# Altium schematic sheet MAIN.SchDoc
size A; DrawnBy: Eduardo
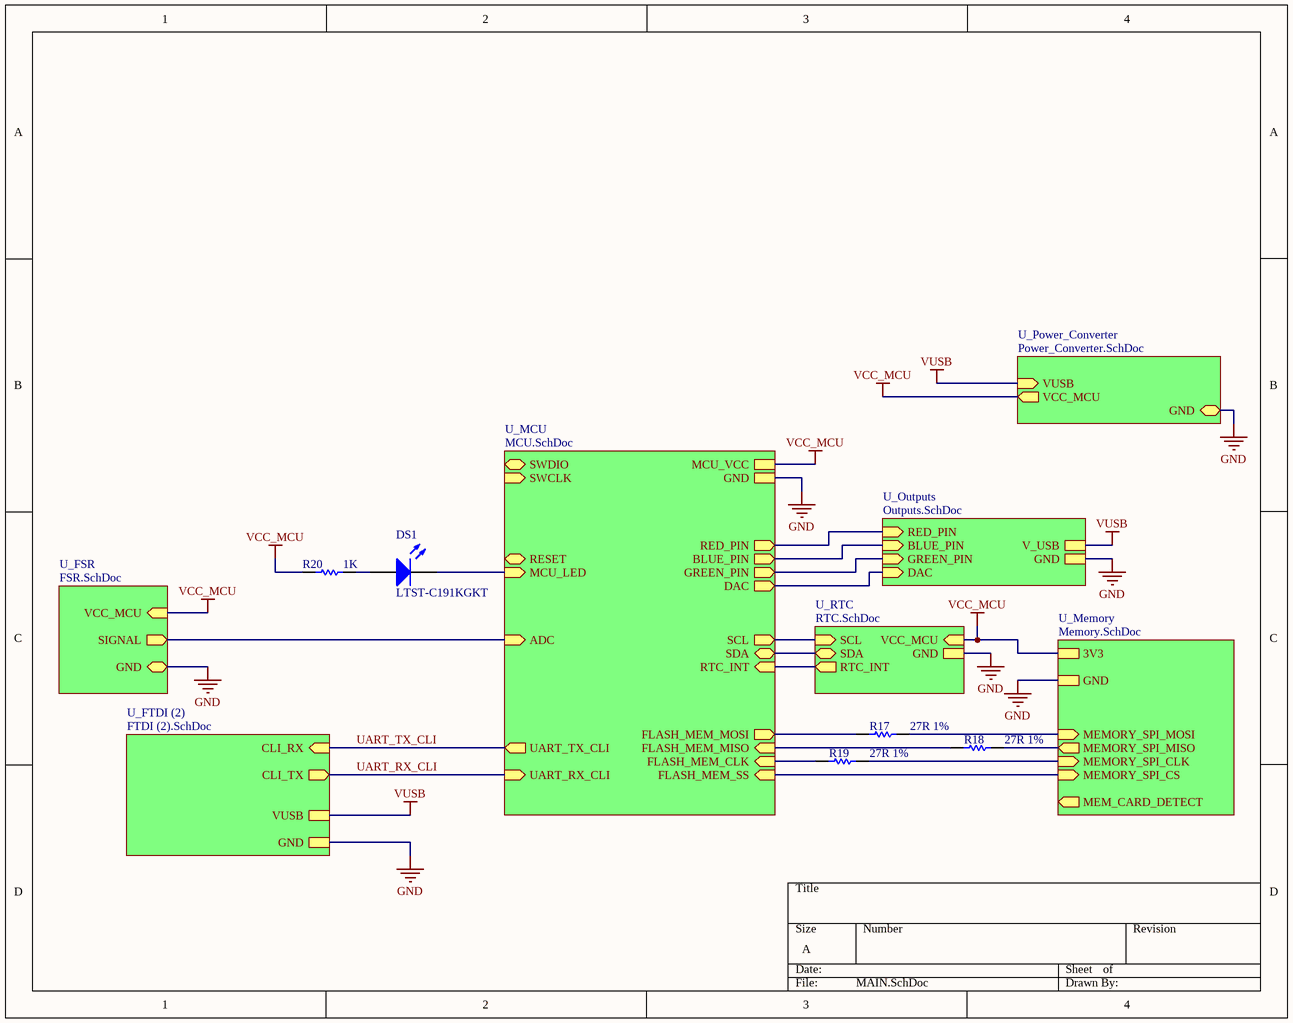
[diagram p0: MAIN.SchDoc]

## Parts
DS1  LTST-C191KGKT  [LITE-ON-LTST-C191KRKT-2_V]
R17  27R 1%  [RESC0603(1608)_N]
R18  27R 1%  [RESC0603(1608)_N]
R19  27R 1%  [RESC0603(1608)_N]
R20  1K  [RESC0603(1608)_M]

## Sub-sheets
U_FSR = FSR.SchDoc: VCC_MCU (in), SIGNAL (out), GND (bidir)
U_FTDI (2) = FTDI (2).SchDoc: CLI_RX (in), CLI_TX (out), VUSB, GND
U_MCU = MCU.SchDoc: SWDIO (bidir), SWCLK (in), UART_TX_CLI (out), UART_RX_CLI (in), FLASH_MEM_SS (in), FLASH_MEM_CLK (in), FLASH_MEM_MISO (in), FLASH_MEM_MOSI (out), RESET (bidir), MCU_LED (in), MCU_VCC, GND, SDA (bidir), SCL (out), DAC (out), RED_PIN (out), GREEN_PIN (out), BLUE_PIN (out), ADC (in), RTC_INT (in)
U_Memory = Memory.SchDoc: MEMORY_SPI_MOSI (in), MEMORY_SPI_MISO (out), MEMORY_SPI_CLK (in), MEMORY_SPI_CS (in), MEM_CARD_DETECT (out), GND, 3V3
U_Outputs = Outputs.SchDoc: RED_PIN (in), BLUE_PIN (in), GREEN_PIN (in), DAC (in), V_USB, GND
U_Power_Converter = Power_Converter.SchDoc: VUSB (in), VCC_MCU (out), GND (bidir)
U_RTC = RTC.SchDoc: SCL (in), RTC_INT (out), SDA (bidir), VCC_MCU (in), GND

## Nets
GND: sheet U_MCU/GND, sheet U_Memory/GND, sheet U_RTC/GND, sheet U_Outputs/GND, sheet U_Power_Converter/GND, sheet U_FSR/GND, sheet U_FTDI (2)/GND
VCC_MCU: R20.1 ; sheet U_MCU/MCU_VCC, sheet U_Memory/3V3, sheet U_RTC/VCC_MCU, sheet U_Power_Converter/VCC_MCU, sheet U_FSR/VCC_MCU
VUSB: sheet U_Outputs/V_USB, sheet U_Power_Converter/VUSB, sheet U_FTDI (2)/VUSB
UART_RX_CLI: sheet U_MCU/UART_RX_CLI, sheet U_FTDI (2)/CLI_TX
UART_TX_CLI: sheet U_MCU/UART_TX_CLI, sheet U_FTDI (2)/CLI_RX
NetDS1_1: DS1.1(A) R20.2
NetDS1_2: DS1.2(K) ; sheet U_MCU/MCU_LED
NetR17_1: R17.1 ; sheet U_MCU/FLASH_MEM_MOSI
NetR17_2: R17.2 ; sheet U_Memory/MEMORY_SPI_MOSI
NetR18_1: R18.1 ; sheet U_MCU/FLASH_MEM_MISO
NetR18_2: R18.2 ; sheet U_Memory/MEMORY_SPI_MISO
NetR19_1: R19.1 ; sheet U_MCU/FLASH_MEM_CLK
NetR19_2: R19.2 ; sheet U_Memory/MEMORY_SPI_CLK
(unnamed): sheet U_MCU/FLASH_MEM_SS, sheet U_Memory/MEMORY_SPI_CS
(unnamed): sheet U_MCU/SDA, sheet U_RTC/SDA
(unnamed): sheet U_MCU/SCL, sheet U_RTC/SCL
(unnamed): sheet U_MCU/DAC, sheet U_Outputs/DAC
(unnamed): sheet U_MCU/RED_PIN, sheet U_Outputs/RED_PIN
(unnamed): sheet U_MCU/GREEN_PIN, sheet U_Outputs/GREEN_PIN
(unnamed): sheet U_MCU/BLUE_PIN, sheet U_Outputs/BLUE_PIN
(unnamed): sheet U_MCU/ADC, sheet U_FSR/SIGNAL
(unnamed): sheet U_MCU/RTC_INT, sheet U_RTC/RTC_INT

## Library data of the parts
DS1 = CMP-2000-05198-1: Chip LED, Green, 574 nm, 40 pF, -55 to 85 degC, 2-Pin SMD, RoHS, Tape and Reel; Manufacturer: Lite-On; Rad Hardened: No; Emitting Color: YellowGreen; Product Height (mm): 0.55mm; Forward Voltage: 2.4V; Number of Elements: 1; Dominant Wave Length: 571nm; DELETED: Compliant; Viewing Angle: 130deg; High Brightness: Yes; Peak Wavelength: 574nm; Type: Uni-Color; Forward Current: 30mA; Product Length (mm): 1.6mm; Luminous Intensity: 35mcd; Test Current (It): 20mA; Chip Material: AlGaInP; Product Depth (mm): 0.8mm; Shape Type: Rectangular; Reverse Voltage: 5V; Power Dissipation: 75W; Pin Count: 2; Lens Dimensions: 1.1X0.8X0.37mm; Packaging: TapeandReel; Main Category: ChipLED; Operating Temperature Classification: Industrial; Package Type: ChipLed; Mounting: SurfaceMount; Lum Intensity: 35mcd; Operating Temp Range: -55Cto85C; Datasheet Version: Jan-07; Datasheet URL: http://download.siliconexpert.com/pdfs/2007/08/26/semi_b/manual/lot/ds/ltst-c191kgkt.pdf; Manufacturer URL: http://www.us.liteon.com/
R17-R19 = CMP-1012-00331-1: 27R 0.1W 1% 0603 (1608 Metric)  SMD; Case-EIA: 0603; Value: 27.00 Ohm; Case-Metric: 1608; Technology: SMT; Tolerance: 1 %; Power: 0.1 W
R20 = CMP-1012-00510-1: 1K 0.1W 1% 0603 (1608 Metric)  SMD; Case-Metric: 1608; Case-EIA: 0603; Value: 1000.00 Ohm; Technology: SMT; Tolerance: 1 %; Power: 0.1 W